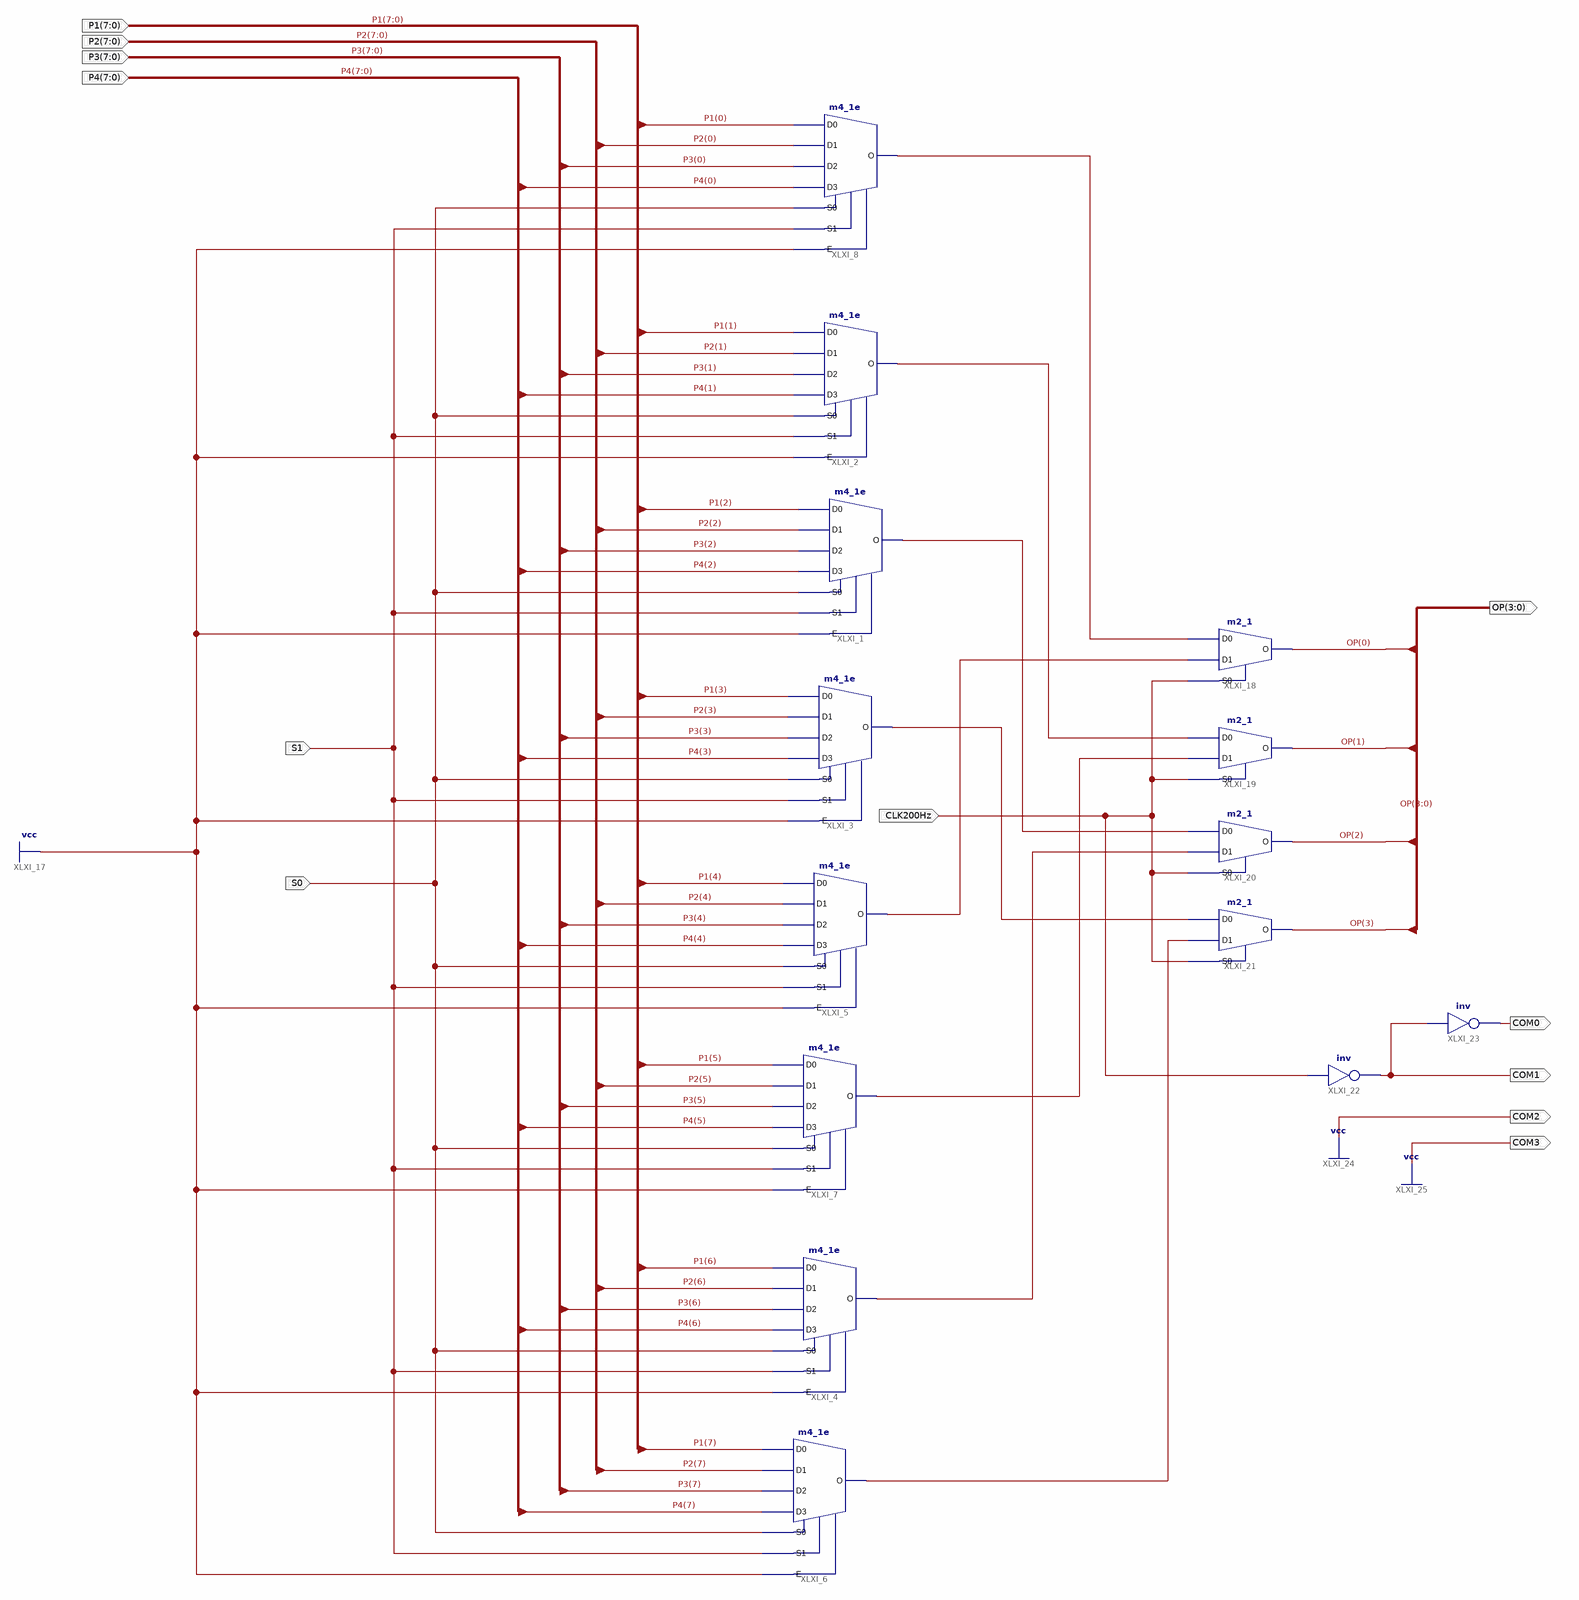
[diagram p0: schematic sheet 1]
// Xilinx ISE schematic MUX8to1.sch (spartan6) as structural Verilog: 14 symbols, 12 ports
module MUX8to1 (
  input  [7:0] P1,
  input  [7:0] P2,
  input  [7:0] P3,
  input  [7:0] P4,
  input  S0,
  input  S1,
  input  CLK200Hz,
  output [3:0] OP,
  output COM1,
  output COM2,
  output COM3,
  output COM0
);

  wire XLXN_45, XLXN_46, XLXN_48, XLXN_49, XLXN_51, XLXN_53, XLXN_54, XLXN_56;

  m4_1e XLXI_1 (.D0(P1[2]), .D1(P2[2]), .D2(P3[2]), .D3(P4[2]), .E(1'b1), .S0(S0), .S1(S1), .O(XLXN_48));
  m4_1e XLXI_3 (.D0(P1[3]), .D1(P2[3]), .D2(P3[3]), .D3(P4[3]), .E(1'b1), .S0(S0), .S1(S1), .O(XLXN_49));
  m4_1e XLXI_5 (.D0(P1[4]), .D1(P2[4]), .D2(P3[4]), .D3(P4[4]), .E(1'b1), .S0(S0), .S1(S1), .O(XLXN_51));
  m4_1e XLXI_7 (.D0(P1[5]), .D1(P2[5]), .D2(P3[5]), .D3(P4[5]), .E(1'b1), .S0(S0), .S1(S1), .O(XLXN_53));
  m4_1e XLXI_4 (.D0(P1[6]), .D1(P2[6]), .D2(P3[6]), .D3(P4[6]), .E(1'b1), .S0(S0), .S1(S1), .O(XLXN_54));
  m4_1e XLXI_6 (.D0(P1[7]), .D1(P2[7]), .D2(P3[7]), .D3(P4[7]), .E(1'b1), .S0(S0), .S1(S1), .O(XLXN_56));
  m4_1e XLXI_8 (.D0(P1[0]), .D1(P2[0]), .D2(P3[0]), .D3(P4[0]), .E(1'b1), .S0(S0), .S1(S1), .O(XLXN_45));
  m4_1e XLXI_2 (.D0(P1[1]), .D1(P2[1]), .D2(P3[1]), .D3(P4[1]), .E(1'b1), .S0(S0), .S1(S1), .O(XLXN_46));
  m2_1 XLXI_18 (.D0(XLXN_45), .D1(XLXN_51), .S0(CLK200Hz), .O(OP[0]));
  m2_1 XLXI_19 (.D0(XLXN_46), .D1(XLXN_53), .S0(CLK200Hz), .O(OP[1]));
  m2_1 XLXI_20 (.D0(XLXN_48), .D1(XLXN_54), .S0(CLK200Hz), .O(OP[2]));
  m2_1 XLXI_21 (.D0(XLXN_49), .D1(XLXN_56), .S0(CLK200Hz), .O(OP[3]));
  not XLXI_22 (COM1, CLK200Hz);
  not XLXI_23 (COM0, COM1);

  assign COM2 = 1'b1;
  assign COM3 = 1'b1;
endmodule
